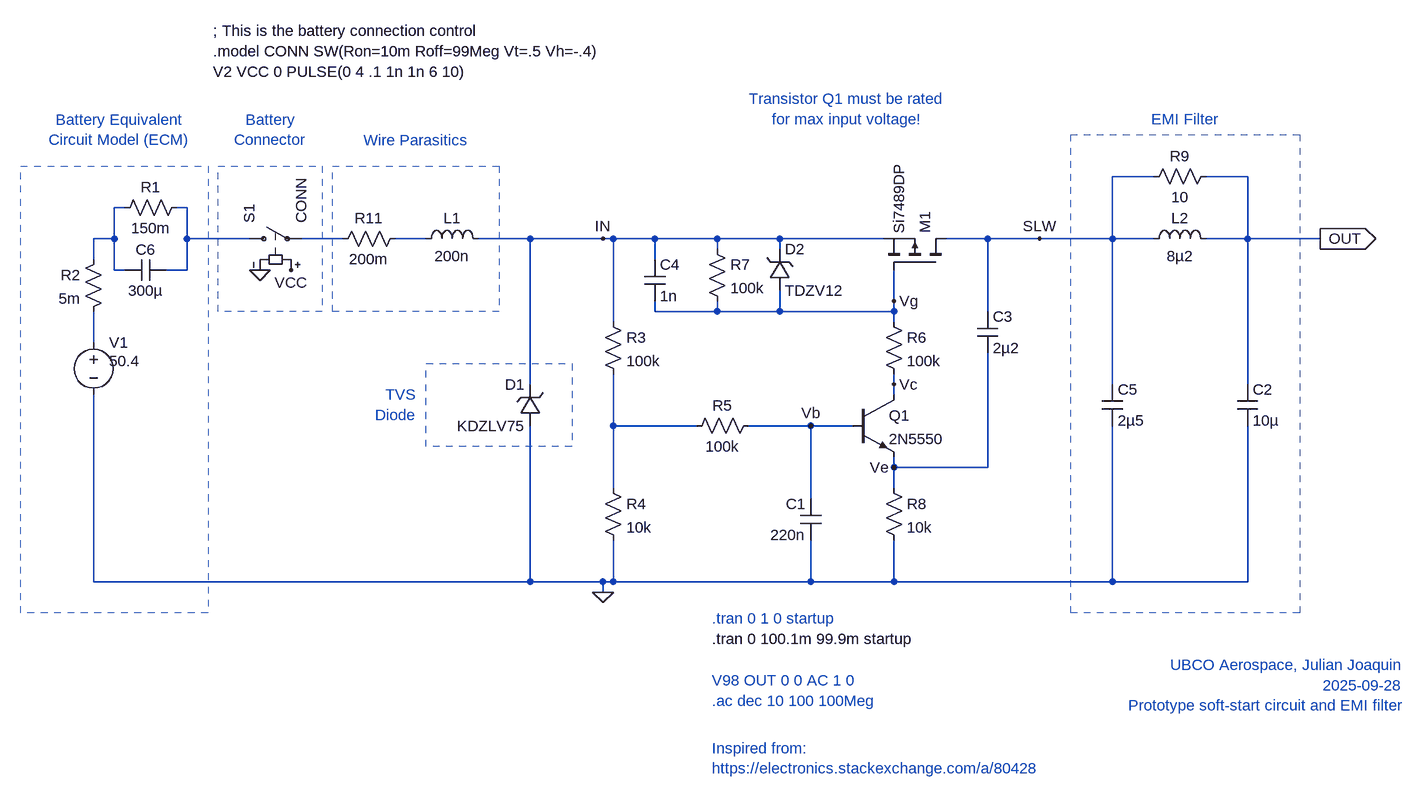
[diagram p0: schematic input_hot_swap_improved.asc]
input_hot_swap_improved.asc, the LTspice schematic file:
Version 4
SHEET 1 1540 876
WIRE 944 -48 880 -48
WIRE 1088 -48 1024 -48
WIRE -640 0 -656 0
WIRE -544 0 -560 0
WIRE -656 48 -656 0
WIRE -656 48 -688 48
WIRE -544 48 -544 0
WIRE -448 48 -544 48
WIRE -304 48 -368 48
WIRE -176 48 -224 48
WIRE -16 48 -96 48
WIRE 96 48 -16 48
WIRE 112 48 96 48
WIRE 176 48 112 48
WIRE 272 48 176 48
WIRE 368 48 272 48
WIRE 528 48 368 48
WIRE 688 48 624 48
WIRE 768 48 688 48
WIRE 880 48 880 -48
WIRE 880 48 768 48
WIRE 944 48 880 48
WIRE 1088 48 1088 -48
WIRE 1088 48 1024 48
WIRE 1200 48 1088 48
WIRE 272 64 272 48
WIRE 368 64 368 48
WIRE -688 80 -688 48
WIRE 176 80 176 48
WIRE -656 96 -656 48
WIRE -640 96 -656 96
WIRE -544 96 -544 48
WIRE -544 96 -576 96
WIRE 544 144 544 96
WIRE 176 160 176 144
WIRE 272 160 272 144
WIRE 272 160 176 160
WIRE 368 160 368 128
WIRE 368 160 272 160
WIRE 544 160 544 144
WIRE 544 160 368 160
WIRE 688 160 688 48
WIRE 112 176 112 48
WIRE 544 176 544 160
WIRE -688 208 -688 160
WIRE -16 272 -16 48
WIRE 544 272 544 256
WIRE 880 272 880 48
WIRE 1088 272 1088 48
WIRE 544 288 544 272
WIRE 112 336 112 256
WIRE 240 336 112 336
WIRE 416 336 320 336
WIRE 480 336 416 336
WIRE 544 400 544 384
WIRE 688 400 688 224
WIRE 688 400 544 400
WIRE 112 432 112 336
WIRE 544 432 544 400
WIRE 416 448 416 336
WIRE -688 576 -688 288
WIRE -16 576 -16 336
WIRE -16 576 -688 576
WIRE 96 576 -16 576
WIRE 112 576 112 512
WIRE 112 576 96 576
WIRE 416 576 416 512
WIRE 416 576 112 576
WIRE 544 576 544 512
WIRE 544 576 416 576
WIRE 880 576 880 336
WIRE 880 576 544 576
WIRE 1088 576 1088 336
WIRE 1088 576 880 576
WIRE 96 592 96 576
FLAG 96 592 0
FLAG 96 48 IN
FLAG 1200 48 OUT
IOPIN 1200 48 Out
FLAG 544 144 Vg
FLAG 544 272 Vc
FLAG 416 336 Vb
FLAG -432 96 0
FLAG -384 96 VCC
FLAG 544 400 Ve
FLAG 768 48 SLW
SYMBOL voltage -688 192 R0
WINDOW 3 24 44 Left 2
WINDOW 123 0 0 Left 0
SYMATTR Value 50.4
SYMATTR SpiceLine Rser=0
SYMATTR InstName V1
SYMBOL pmos 624 96 M270
SYMATTR InstName M1
SYMATTR Value Si7489DP
SYMBOL res 96 160 R0
SYMATTR InstName R3
SYMATTR Value 100k
SYMBOL res 96 416 R0
SYMATTR InstName R4
SYMATTR Value 10k
SYMBOL res 336 320 R90
WINDOW 0 0 56 VBottom 2
WINDOW 3 32 56 VTop 2
SYMATTR InstName R5
SYMATTR Value 100k
SYMBOL cap 432 512 R180
WINDOW 0 24 56 Left 2
WINDOW 3 24 8 Left 2
SYMATTR InstName C1
SYMATTR Value 220n
SYMBOL res 528 160 R0
SYMATTR InstName R6
SYMATTR Value 100k
SYMBOL res 256 48 R0
SYMATTR InstName R7
SYMATTR Value 100k
SYMBOL res 528 416 R0
SYMATTR InstName R8
SYMATTR Value 10k
SYMBOL cap 672 160 R0
SYMATTR InstName C3
SYMATTR Value 2µ2
SYMATTR SpiceLine V=100 Irms=0 Rser=2m Lser=0
SYMBOL res -208 32 R90
WINDOW 0 0 56 VBottom 2
WINDOW 3 32 56 VTop 2
SYMATTR InstName R11
SYMATTR Value 200m
SYMBOL ind -192 64 R270
WINDOW 0 32 56 VTop 2
WINDOW 3 5 56 VBottom 2
SYMATTR InstName L1
SYMATTR Value 200n
SYMBOL cap 1072 272 R0
SYMATTR InstName C2
SYMATTR Value 10µ
SYMATTR SpiceLine Rser=.5m
SYMBOL cap 160 80 R0
SYMATTR InstName C4
SYMATTR Value 1n
SYMATTR SpiceLine Rser=5m
SYMBOL zener 0 336 R180
WINDOW 0 24 64 Left 2
WINDOW 3 24 0 Left 2
SYMATTR InstName D1
SYMATTR Value KDZLV75
SYMBOL zener 352 128 M180
WINDOW 0 24 64 Left 2
WINDOW 3 24 0 Left 2
SYMATTR InstName D2
SYMATTR Value TDZV12
SYMBOL cap 864 272 R0
SYMATTR InstName C5
SYMATTR Value 2µ5
SYMATTR SpiceLine Rser=2m
SYMBOL ind 928 64 R270
WINDOW 0 32 56 VTop 2
WINDOW 3 5 56 VBottom 2
SYMATTR InstName L2
SYMATTR Value 8µ2
SYMATTR SpiceLine Rser=60m
SYMBOL res 1040 -64 R90
WINDOW 0 0 56 VBottom 2
WINDOW 3 32 56 VTop 2
SYMATTR InstName R9
SYMATTR Value 10
SYMBOL sw -464 48 R270
SYMATTR InstName S1
SYMATTR Value CONN
SYMBOL npn 480 288 R0
SYMATTR InstName Q1
SYMATTR Value 2N5550
SYMBOL cap -576 80 R90
WINDOW 0 0 32 VBottom 2
WINDOW 3 32 32 VTop 2
SYMATTR InstName C6
SYMATTR Value 300µ
SYMBOL res -544 -16 R90
WINDOW 0 0 56 VBottom 2
WINDOW 3 32 56 VTop 2
SYMATTR InstName R1
SYMATTR Value 150m
SYMBOL res -672 64 M0
SYMATTR InstName R2
SYMATTR Value 5m
TEXT 264 664 Left 2 !.tran 0 100.1m 99.9m startup
TEXT 264 832 Left 2 ;Inspired from:\nhttps://electronics.stackexchange.com/a/80428
TEXT 264 632 Left 2 ;.tran 0 1 0 startup
TEXT 264 728 Left 2 ;V98 OUT 0 0 AC 1 0\n.ac dec 10 100 100Meg
TEXT 472 -152 Center 2 ;Transistor Q1 must be rated\nfor max input voltage!
TEXT -504 -272 Left 2 !; This is the battery connection control\n.model CONN SW(Ron=10m Roff=99Meg Vt=.5 Vh=-.4)\nV2 VCC 0 PULSE(0 4 .1 1n 1n 6 10)
TEXT -648 -120 Center 2 ;Battery Equivalent\nCircuit Model (ECM)
TEXT -416 -120 Center 2 ;Battery\nConnector
TEXT -192 -104 Center 2 ;Wire Parasitics
TEXT 1328 704 Right 2 ;UBCO Aerospace, Julian Joaquin\n2025-09-28\nPrototype soft-start circuit and EMI filter
TEXT 992 -136 Center 2 ;EMI Filter
TEXT -192 288 Right 2 ;TVS\nDiode
RECTANGLE Normal -512 624 -800 -64 2
RECTANGLE Normal -336 160 -496 -64 2
RECTANGLE Normal -64 160 -320 -64 2
RECTANGLE Normal 1168 624 816 -112 2
RECTANGLE Normal 48 368 -176 240 2

The netlist it stands for:
* input_hot_swap_improved.asc
V1 N005 0 50.4 Rser=0
M1 SLW Vg IN IN Si7489DP
R3 IN N006 100k
R4 N006 0 10k
R5 Vb N006 100k
C1 0 Vb 220n
R6 Vg Vc 100k
R7 IN Vg 100k
R8 Ve 0 10k
C3 SLW Ve 2µ2 V=100 Irms=0 Rser=2m Lser=0
R11 N004 N003 200m
L1 N004 IN 200n
C2 OUT 0 10µ Rser=.5m
C4 IN Vg 1n Rser=5m
D1 0 IN KDZLV75
D2 Vg IN TDZV12
C5 SLW 0 2µ5 Rser=2m
L2 SLW OUT 8µ2 Rser=60m
R9 OUT SLW 10
S1 N002 N003 VCC 0 CONN
Q1 Vc Vb Ve 0 2N5550
C6 N002 N001 300µ
R1 N002 N001 150m
R2 N001 N005 5m
.model D D
.lib standard.dio
.model NPN NPN
.model PNP PNP
.lib standard.bjt
.model NMOS NMOS
.model PMOS PMOS
.lib standard.mos
.tran 0 100.1m 99.9m startup
* Inspired from:
* https://electronics.stackexchange.com/a/80428
* .tran 0 1 0 startup
* V98 OUT 0 0 AC 1 0
* .ac dec 10 100 100Meg
* Transistor Q1 must be rated
* for max input voltage!
; This is the battery connection control
.model CONN SW(Ron=10m Roff=99Meg Vt=.5 Vh=-.4)
V2 VCC 0 PULSE(0 4 .1 1n 1n 6 10)
* Battery Equivalent
* Circuit Model (ECM)
* Battery
* Connector
* Wire Parasitics
* UBCO Aerospace, Julian Joaquin
* 2025-09-28
* Prototype soft-start circuit and EMI filter
* EMI Filter
* TVS
* Diode
.backanno
.end